# EAGLE design cape (EAGLE 7.2.0)
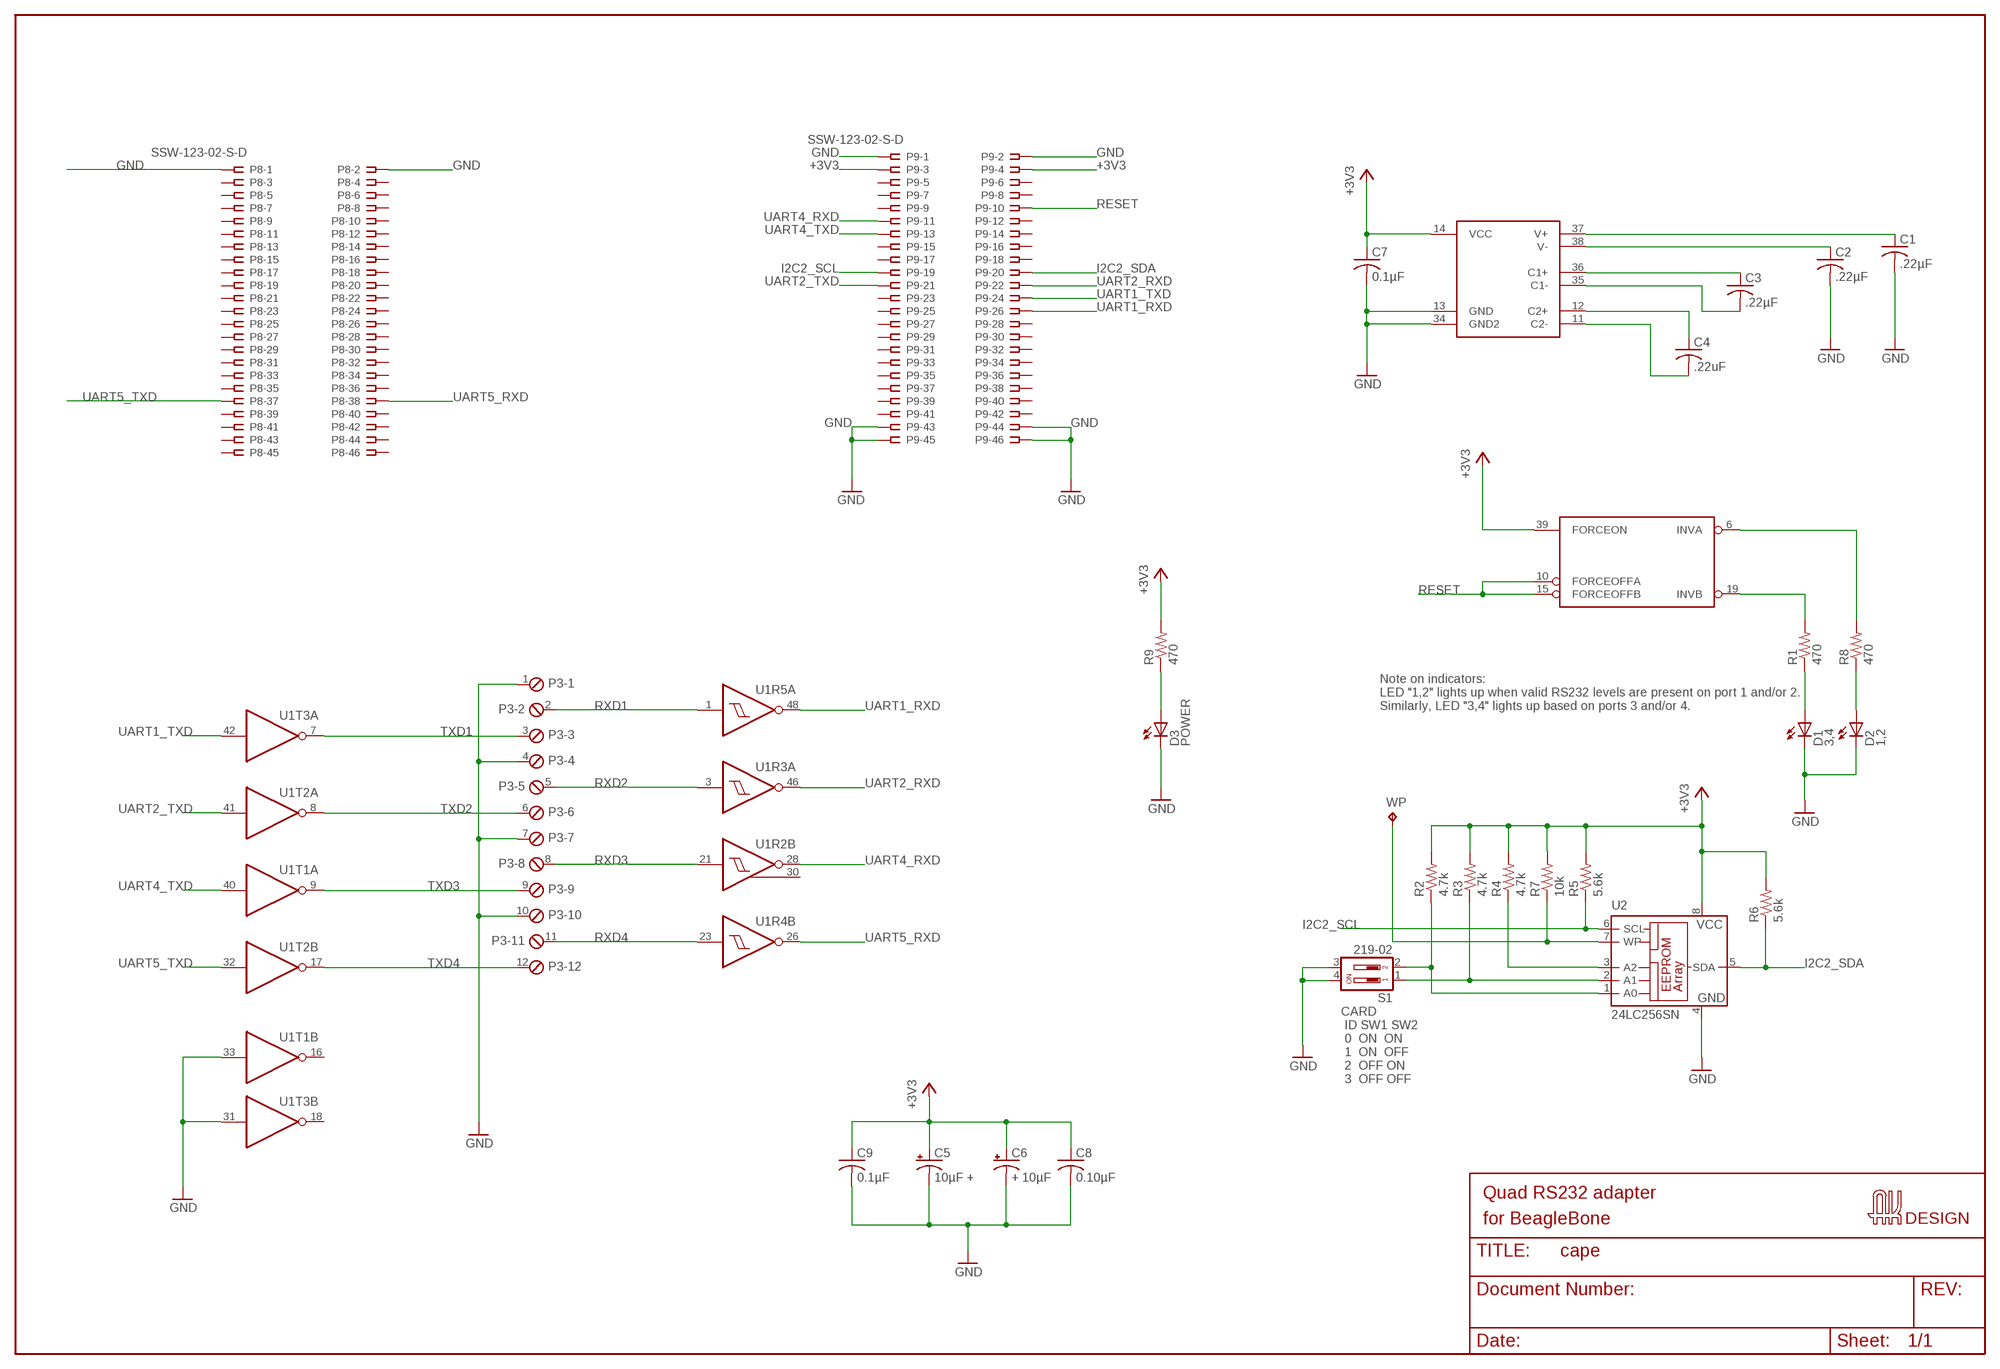
[diagram p0: schematic, sheet 1]

## Parts
C1  .22µF  C-USC0603  [C0603]
C2  .22µF  C-USC0603  [C0603]
C3  .22µF  C-USC0603  [C0603]
C4  .22uF  C-USC0603  [C0603]
C5  10µF +  CPOL-USC1206  [C1206]
C6  + 10µF  CPOL-USC1206  [C1206]
C7  0.1µF  C-USC0603  [C0603]
C8  0.10µF  C-USC0603  [C0603]
C9  0.1µF  C-USC0603  [C0603]
D1  3,4  LEDCHIPLED_0603  [CHIPLED_0603]
D2  1,2  LEDCHIPLED_0603  [CHIPLED_0603]
D3  POWER  LEDCHIPLED_0603  [CHIPLED_0603]
P3  MPT12  [12POL254]
P8  SSW-123-02-S-D  [SSW-123-02-S-D]
P9  SSW-123-02-S-D  [SSW-123-02-S-D]
R1  470  R-US_R0603  [R0603]
R2  4.7k  R-US_R0603  [R0603]
R3  4.7k  R-US_R0603  [R0603]
R4  4.7k  R-US_R0603  [R0603]
R5  5.6k  R-US_R0603  [R0603]
R6  5.6k  R-US_R0603  [R0603]
R7  10k  R-US_R0603  [R0603]
R8  470  R-US_R0603  [R0603]
R9  470  R-US_R0603  [R0603]
S1  219-02  [CTS-219-02]
U1  SN75C23243  SN75C23243SN75C23243DL  [SSOP48DL]
U2  24LC256SN  [SO-08]
U$3  LOGO/PLACE  [LOGO_PLACE]
WP  TPTP15SQ  [TP15SQ]

## Nets
+3V3 [supply]: C5.1(+) C6.1(+) C7.1 C8.1 C9.1 P9.3 P9.4 R2.2 R3.2 R4.2 R5.2 R6.2 R7.2 R9.2 U1.14(POWER:VCC) U1.39(CTRL:FORCEON) U2.8(VCC)
A0: R2.1 S1.2 U2.1(A0)
A1: R3.1 S1.1 U2.2(A1)
A2: R4.1 U2.3(A2)
C1+: C3.1 U1.36(POWER:C1+)
C1-: C3.2 U1.35(POWER:C1-)
C2+: C4.1 U1.12(POWER:C2+)
C2-: C4.2 U1.11(POWER:C2-)
GND [supply]: C1.2 C2.2 C5.2(-) C6.2(-) C7.2 C8.2 C9.2 D1.C D2.C D3.C P3.1 P3.4 P3.7 P3.10 P8.1 P8.2 P9.1 P9.2 P9.43 P9.44 P9.45 P9.46 S1.3 S1.4 U1.13(POWER:GND) U1.31(T3B:I) U1.33(T1B:I) U1.34(POWER:GND2) U2.4(GND)
I2C2_SCL: P9.19 R5.1 U2.6(SCL)
I2C2_SDA: P9.20 R6.1 U2.5(SDA)
INVA: R8.2 U1.6(CTRL:INVA)
INVB: R1.2 U1.19(CTRL:INVB)
LED1_2: D2.A R8.1
LED3_4: D1.A R1.1
N$1: D3.A R9.1
RESET: P9.10 U1.10(CTRL:FORCEOFFA) U1.15(CTRL:FORCEOFFB)
RXD1: P3.2 U1.1(R5A:I)
RXD2: P3.5 U1.3(R3A:I)
RXD3: P3.8 U1.21(R2B:I)
RXD4: P3.11 U1.23(R4B:I)
TXD1: P3.3 U1.7(T3A:O)
TXD2: P3.6 U1.8(T2A:O)
TXD3: P3.9 U1.9(T1A:O)
TXD4: P3.12 U1.17(T2B:O)
UART1_RXD: P9.26 U1.48(R5A:O)
UART1_TXD: P9.24 U1.42(T3A:I)
UART2_RXD: P9.22 U1.46(R3A:O)
UART2_TXD: P9.21 U1.41(T2A:I)
UART4_RXD: P9.11 U1.28(R2B:O)
UART4_TXD: P9.13 U1.40(T1A:I)
UART5_RXD: P8.38 U1.26(R4B:O)
UART5_TXD: P8.37 U1.32(T2B:I)
V+: C1.1 U1.37(POWER:V+)
V-: C2.1 U1.38(POWER:V-)
WP: R7.1 U2.7(WP) WP.TP
Unconnected: P8.3 P8.4 P8.5 P8.6 P8.7 P8.8 P8.9 P8.10 P8.11 P8.12 P8.13 P8.14 P8.15 P8.16 P8.17 P8.18 P8.19 P8.20 P8.21 P8.22 P8.23 P8.24 P8.25 P8.26 P8.27 P8.28 P8.29 P8.30 P8.31 P8.32 P8.33 P8.34 P8.35 P8.36 P8.39 P8.40 P8.41 P8.42 P8.43 P8.44 P8.45 P8.46 P9.5 P9.6 P9.7 P9.8 P9.9 P9.12 P9.14 P9.15 P9.16 P9.17 P9.18 P9.23 P9.25 P9.27 P9.28 P9.29 P9.30 P9.31 P9.32 P9.33 P9.34 P9.35 P9.36 P9.37 P9.38 P9.39 P9.40 P9.41 P9.42 U1.2(R4A:I) U1.4(R2A:I) U1.5(R1A:I) U1.16(T1B:O) U1.18(T3B:O) U1.20(R1B:I) U1.22(R3B:I) U1.24(R5B:I) U1.25(R5B:O) U1.27(R3B:O) U1.29(R1B:O) U1.30(R2B:OINV) U1.43(R2A:OINV) U1.44(R1A:O) U1.45(R2A:O) U1.47(R4A:O)

## Notes on the sheet
- Note on indicators:
  LED "1,2" lights up when valid RS232 levels are present on port 1 and/or 2.
  Similarly, LED "3,4" lights up based on ports 3 and/or 4.
- CARD
   ID SW1 SW2
   0  ON  ON
   1  ON  OFF
   2  OFF ON
   3  OFF OFF
- Quad RS232 adapter
- for BeagleBone

## Library data of the parts
C1-C4 C7-C9 = rcl:C-US: CAPACITOR, American symbol
C5 C6 = resistor:CPOL-US: POLARIZED CAPACITOR, American symbol
D1-D3 = led:LED: LED OSRAM: - CHIPLED LG R971, LG N971, LY N971, LG Q971, LY Q971, LO R971, LY R971 LH N974, LH R974 LS Q976, LO Q976, LY Q976 LO Q996 - Hyper CHIPLED LW Q18S LB Q993, LB Q99A, LB R99A - SideLED LS A670, LO A670, LY A670, LG A670, LP A670 LB A673, LV A673, LT A673, LW A673 LH A674 LY A675 LS A676, LA A676, LO A676, LY A676, LW A676 LS A679, LY A679, LG A679 - Hyper Micro SIDELED® LS Y876, LA Y876, LO Y876, LY Y876 LT Y87S - SmartLED LW L88C, LW L88S LB L89C, LB L89S, LG L890 LS L89K, LO L89K, LY L89K LS L896, LA L896, LO L896, LY L896 - TOPLED LS T670, LO T670, LY T670, LG T670, LP T670 LSG T670, LSP T670, LSY T670, LOP T670, LYG T670 LG T671, LOG T671, LSG T671 LB T673, LV T673, LT T673, LW T673 LH T674 LS T676, LA T676, LO T676, LY T676, LB T676, LH T676, LSB T676, LW T676 LB T67C, LV T67C, LT T67C, LS T67K, LO T67K, LY T67K, LW E67C LS E67B, LA E67B, LO E67B, LY E67B, LB E67C, LV E67C, LT E67C LW T67C LS T679, LY T679, LG T679 LS T770, LO T770, LY T770, LG T770, LP T770 LB T773, LV T773, LT T773, LW T773 LH T774 LS E675, LA E675, LY E675, LS T675 LS T776, LA T776, LO T776, LY T776, LB T776 LHGB T686 LT T68C, LB T68C - Hyper Mini TOPLED® LB M676 - Mini TOPLED Santana® LG M470 LS M47K, LO M47K, LY M47K Source: http://www.osram.convergy.de LUXEON: - LUMILED® LXK2-PW12-R00, LXK2-PW12-S00, LXK2-PW14-U00, LXK2-PW14-V00 LXK2-PM12-R00, LXK2-PM12-S00, LXK2-PM14-U00 LXK2-PE12-Q00, LXK2-PE12-R00, LXK2-PE12-S00, LXK2-PE14-T00, LXK2-PE14-U00 LXK2-PB12-K00, LXK2-PB12-L00, LXK2-PB12-M00, LXK2-PB14-N00, LXK2-PB14-P00, LXK2-PB14-Q00 LXK2-PR12-L00, LXK2-PR12-M00, LXK2-PR14-Q00, LXK2-PR14-R00 LXK2-PD12-Q00, LXK2-PD12-R00, LXK2-PD12-S00 LXK2-PH12-R00, LXK2-PH12-S00 LXK2-PL12-P00, LXK2-PL12-Q00, LXK2-PL12-R00 Source: www.luxeon.com KINGBRIGHT: KA-3528ASYC Source: www.kingbright.com
P3 = con-phoenix-254:MPT12: PHOENIX CONNECTOR
P8 P9 = con-samtec:SSW-123-02-S-D: THROUGH-HOLE .025" SQ POST SOCKET Source: Samtec SSW.pdf; MPN: SSW-123-02-S-D; OC_FARNELL: unknown; OC_NEWARK: 11P9690
R1-R9 = rcl:R-US_: RESISTOR, American symbol
S1 = switch-dil:219-02*: Surface Mount DIP Switch Series 219 SMT CTS Electronic Components Sourc: www.ctscorp.com
U1 = texas:SN75C23243: SN75C23243 dual RS232 port
U2 = microchip:24*: Serial EEPROM I2C
U$3 = akdesign:LOGO
WP = testpad:TP: Test pad

## Net classes
0 default: width 0.254 mm
1 supply: width 0.254 mm

## Board
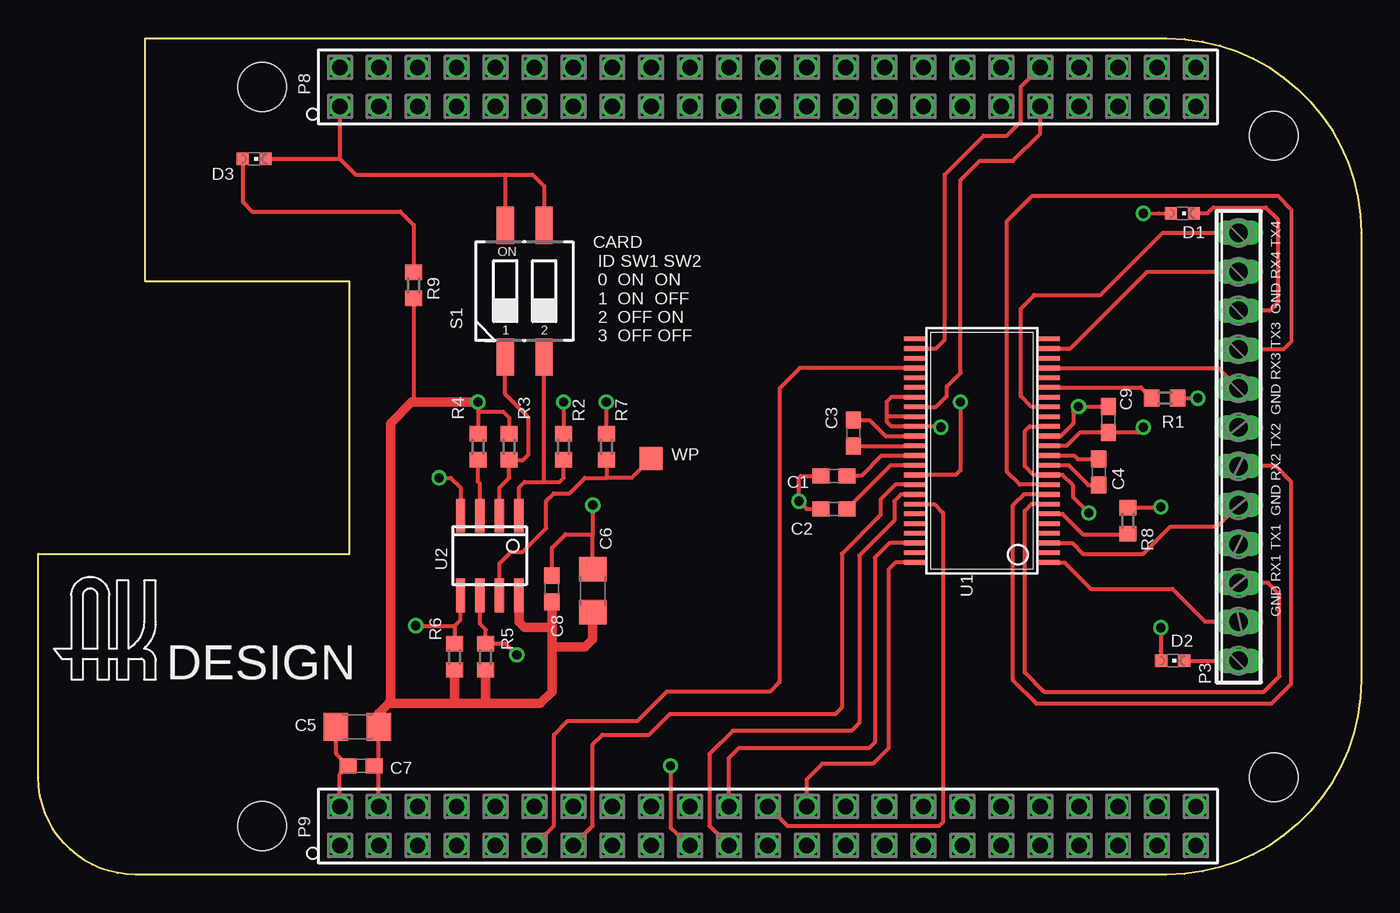
[diagram p1: board, top side]
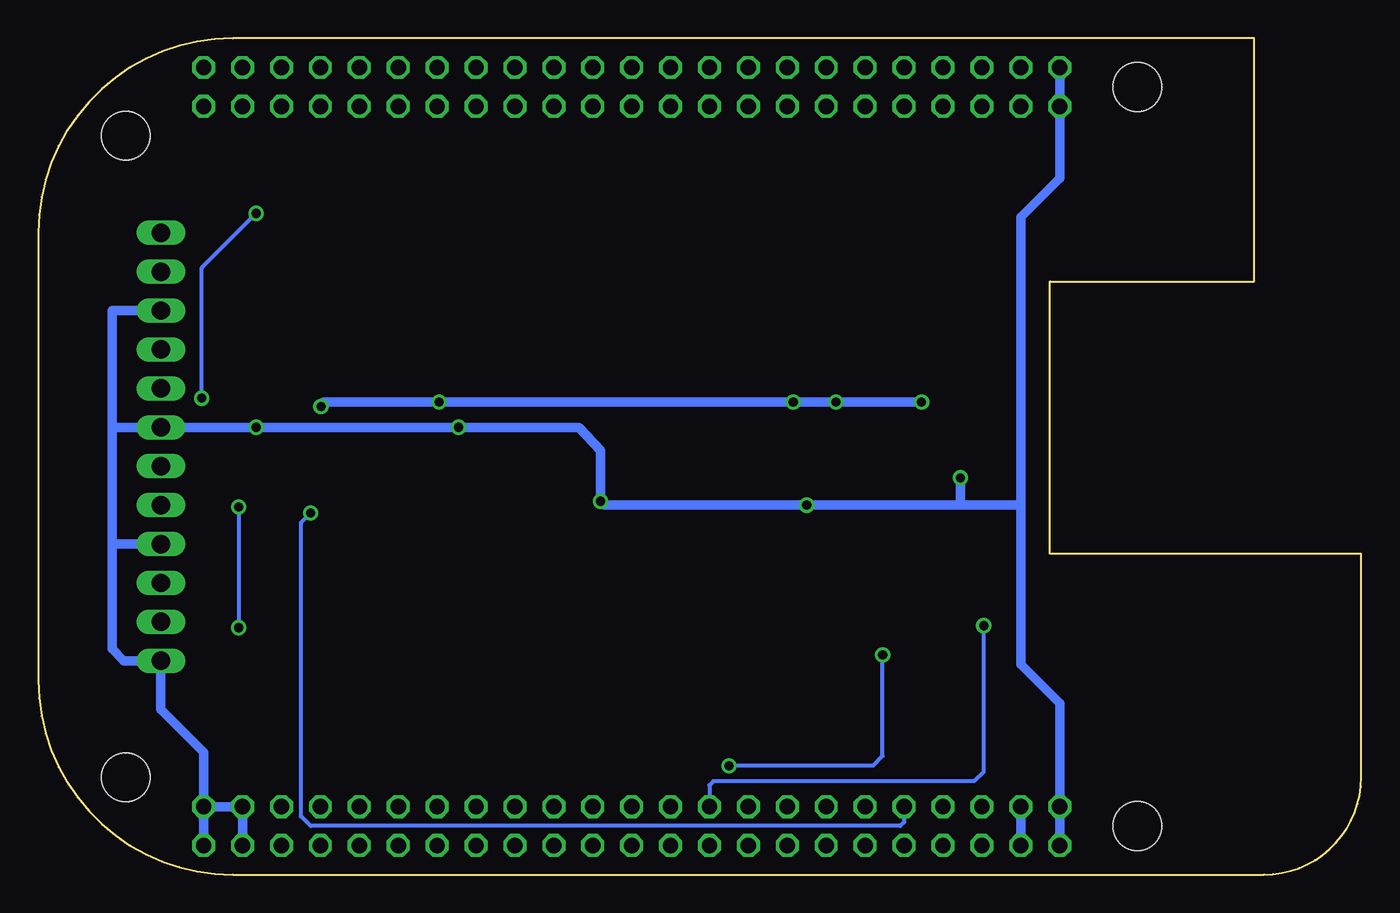
[diagram p2: board, bottom side, seen from below]

Size 86.36 x 54.61 mm. Coordinates in mm from the lower left corner, seen from the top.
Outline: 0,6.35 0,20.95 20.32,20.95 20.32,38.73 6.99,38.73 6.99,54.61 73.66,54.61 arc-90 86.36,41.91 86.36,12.7 arc-90 73.66,0 6.35,0 arc-90 0,6.35
Copper layers (1*16): Top 0.035mm / dielectric 1.5mm / Bottom 0.035mm
Design rules "PCB-POOL Standard via fixed": minimum track width 0.15mm, minimum drill 0.3mm, track to track 0.15mm, track to pad 0.15mm, pad to pad 0.15mm, via to via 0.15mm, smd to smd 0.15mm, copper to edge 0.3mm, drill to drill 0.2mm, minimum pad ring 0.2mm, minimum via ring 0.2mm, stop-mask expansion 0.075mm, vias tented up to drill 0mil, thermal gap 0.2mm
Holes 3.17 mm at 14.61,51.44 80.64,48.26 14.61,3.17 80.64,6.35

### Footprints (pad centres in the part's own frame; a part is rotated, then mirrored left to right if it is on the bottom)
C0603 = smd 1.1 x 1: 1 -0.85,0; 2 0.85,0
C1206 = smd 1.6 x 1.8: 1 -1.4,0; 2 1.4,0
CHIPLED_0603 = smd 0.8 x 0.8: A 0,-0.75; C 0,0.75
12POL254 = drill 1.2 long: 1 -13.97,0; 2 -11.43,0; 3 -8.89,0; 4 -6.35,0; 5 -3.81,0; 6 -1.27,0; 7 1.27,0; 8 3.81,0; 9 6.35,0; 10 8.89,0; 11 11.43,0; 12 13.97,0
SSW-123-02-S-D = drill 1 pad 1.5 octagon: 1 -27.94,-1.27; 2 -27.94,1.27; 3 -25.4,-1.27; 4 -25.4,1.27; 5 -22.86,-1.27; 6 -22.86,1.27; 7 -20.32,-1.27; 8 -20.32,1.27; 9 -17.78,-1.27; 10 -17.78,1.27; 11 -15.24,-1.27; 12 -15.24,1.27; 13 -12.7,-1.27; 14 -12.7,1.27; 15 -10.16,-1.27; 16 -10.16,1.27; 17 -7.62,-1.27; 18 -7.62,1.27; 19 -5.08,-1.27; 20 -5.08,1.27; 21 -2.54,-1.27; 22 -2.54,1.27; 23 0,-1.27; 24 0,1.27; 25 2.54,-1.27; 26 2.54,1.27; 27 5.08,-1.27; 28 5.08,1.27; 29 7.62,-1.27; 30 7.62,1.27; 31 10.16,-1.27; 32 10.16,1.27; 33 12.7,-1.27; 34 12.7,1.27; 35 15.24,-1.27; 36 15.24,1.27; 37 17.78,-1.27; 38 17.78,1.27; 39 20.32,-1.27; 40 20.32,1.27; 41 22.86,-1.27; 42 22.86,1.27; 43 25.4,-1.27; 44 25.4,1.27; 45 27.94,-1.27; 46 27.94,1.27
R0603 = smd 1 x 1.1: 1 -0.85,0; 2 0.85,0
CTS-219-02 = smd 1.13 x 2.44: 1 -1.27,-4.3; 2 1.27,-4.3; 3 1.27,4.3; 4 -1.27,4.3
SSOP48DL = smd 0.305 x 1.397: 1 -7.303,-4.381; 2 -6.668,-4.381; 3 -6.032,-4.381; 4 -5.397,-4.381; 5 -4.763,-4.381; 6 -4.128,-4.381; 7 -3.493,-4.381; 8 -2.857,-4.381; 9 -2.223,-4.381; 10 -1.587,-4.381; 11 -0.953,-4.381; 12 -0.318,-4.381; 13 0.318,-4.381; 14 0.953,-4.381; 15 1.587,-4.381; 16 2.223,-4.381; 17 2.857,-4.381; 18 3.493,-4.381; 19 4.128,-4.381; 20 4.763,-4.381; 21 5.397,-4.381; 22 6.032,-4.381; 23 6.668,-4.381; 24 7.303,-4.381; 25 7.303,4.381; 26 6.668,4.381; 27 6.032,4.381; 28 5.397,4.381; 29 4.763,4.381; 30 4.128,4.381; 31 3.493,4.381; 32 2.857,4.381; 33 2.223,4.381; 34 1.587,4.381; 35 0.953,4.381; 36 0.318,4.381; 37 -0.318,4.381; 38 -0.953,4.381; 39 -1.587,4.381; 40 -2.223,4.381; 41 -2.857,4.381; 42 -3.493,4.381; 43 -4.128,4.381; 44 -4.763,4.381; 45 -5.397,4.381; 46 -6.032,4.381; 47 -6.668,4.381; 48 -7.303,4.381
SO-08 = smd 0.6 x 2.2: 1 -1.905,-2.6; 2 -0.635,-2.6; 3 0.635,-2.6; 4 1.905,-2.6; 5 1.905,2.6; 6 0.635,2.6; 7 -0.635,2.6; 8 -1.905,2.6
TP15SQ = smd 1.5 x 1.5: TP 0,0

### Placement (x,y rotation side)
C1  51.94,26.04 180 top
C2  51.94,23.88 180 top
C3  53.21,28.83 90 top
C4  69.22,26.29 270 top
C5  20.83,9.65 180 top
C6  36.2,18.54 90 top
C7  21.08,7.11 180 top
C8  33.53,18.67 90 top
C9  69.85,29.72 270 top
D1  74.68,43.18 270 top
D2  74.04,13.97 270 top
D3  14.1,46.74 270 top
P3  78.36,27.94 90 top
P8  47.62,51.44 0 top
P9  47.62,3.17 0 top
R1  73.53,31.11 180 top
R2  34.29,27.94 90 top
R3  30.73,27.94 90 top
R4  28.7,27.94 90 top
R5  29.21,14.22 270 top
R6  27.18,14.22 270 top
R7  37.08,27.94 90 top
R8  71.12,23.11 270 top
R9  24.51,38.48 270 top
S1  31.75,38.1 0 top
U1  61.59,27.69 90 top
U2  29.46,20.83 180 top
U$3  1.27,12.57 0 top
WP  40.01,27.18 0 top

### Tracks (layer width: path | path; a pad name or v marks a point on that pad's centre or on a via)
+3V3  (via drill 0.6)
  Top 0.254: P9.4 22.23,6.82 C7.1 22.2,7.38 C5.1 | U1.39 59.88,26.1 60.2,26.42 v60.2,30.86 | U1.14 66.74,28.64 67.56,29.46 67.56,30.23 v67.91,30.57 C9.1 | v34.29,30.86 R2.2 | R3.2 30.73,29.84 30.35,30.23 28.7,30.23 | 28.7,30.23 R4.2 | v28.7,30.86 28.7,30.23 | R7.2 v37.08,30.86 | R9.2 24.51,30.99 24.38,30.86
  Top 0.61: C5.1 22.2,10.52 22.86,11.18 22.99,11.18 | 22.99,11.18 27.18,11.18 | 27.18,11.18 29.21,11.18 | 27.18,11.18 R6.2 | 29.21,11.18 R5.2 | 22.99,11.18 22.99,29.46 24.38,30.86 v28.7,30.86 | C6.1 36.2,15.37 35.69,14.86 33.53,14.86 | C8.1 33.53,16 | 33.53,16 33.53,14.86 | 33.53,14.86 33.53,11.94 32.77,11.18 29.21,11.18 | U2.8 31.37,16.51 31.75,16.13 33.4,16.13 33.53,16
  Bottom 0.61: P9.3 P9.4 | v67.91,30.57 67.74,30.86 v60.2,30.86 v37.08,30.86 v34.29,30.86 v28.7,30.86
A0
  Top 0.254: U2.1 31.37,25.27 31.75,25.65 33.02,25.65 | R2.1 34.29,25.91 34.04,25.65 33.02,25.65 | 33.02,25.65 S1.2
A1
  Top 0.254: U2.2 30.1,25.27 30.73,25.91 R3.1 31.66,27.09 32,27.43 32,29.84 30.48,31.37 S1.1
A2
  Top 0.254: U2.3 28.83,25.53 28.7,25.65 R4.1
C1+
  Top 0.254: U1.36 53.24,28 C3.1
C1-
  Top 0.254: U1.35 55.31,28.64 54.27,29.68 C3.2
C2+
  Top 0.254: C4.1 67.86,27.14 67.63,27.37 U1.12
C2-
  Top 0.254: U1.11 67.25,26.73 68.54,25.44 C4.2
GND  (via drill 0.6)
  Top 0.254: 30.48,45.72 S1.4 | 30.48,45.72 20.7,45.72 19.68,46.74 | P8.1 19.68,46.74 | S1.3 33.02,44.96 32.26,45.72 30.48,45.72 | P9.2 19.68,6.57 C7.2 19.45,7.89 C5.2 | v72.14,29.21 71.79,28.87 C9.2 67.98,28.87 67.12,28 U1.13 | v58.93,29.21 58.74,29.27 U1.34 55.69,29.27 55.37,29.59 55.37,29.97 | C1.2 49.78,26.04 49.66,25.91 v49.66,24.38 50.16,23.88 C2.2 | U2.4 27.56,25.27 26.92,25.91 v26.16,25.91 | C8.2 33.53,21.34 34.42,22.23 36.2,22.23 | C6.2 36.2,22.23 | v36.2,24.13 36.2,22.23 | U1.31 55.69,31.18 55.37,30.86 55.37,29.97 | U1.33 55.44,29.91 55.37,29.97 | D3.C 19.68,46.74 | D2.C P3.1 | D1.C 76.33,43.18 76.71,43.56 80.14,43.56 80.9,42.8 80.9,37.34 80.39,36.83 P3.10
  Bottom 0.406: 49.4,24.13 v49.66,24.38
  Bottom 0.61: P8.2 P8.1 19.68,45.47 22.23,42.93 22.23,24.13 | P9.1 P9.2 19.68,11.18 22.23,13.72 22.23,24.13 | P9.43 P9.44 P9.46 | P9.46 P9.45 | P3.10 81.53,36.83 81.53,29.21 | 81.53,29.21 P3.7 v72.14,29.21 v58.93,29.21 51.05,29.21 49.66,27.69 v49.66,24.38 | 81.53,29.21 81.53,21.59 | 81.53,21.59 P3.4 | 81.53,21.59 81.53,14.73 80.77,13.97 P3.1 78.36,10.79 75.56,8 P9.46 | 26.16,24.13 v36.2,24.13 49.4,24.13 | 22.23,24.13 26.16,24.13 | 26.16,24.13 v26.16,25.91
I2C2_SCL  (via drill 0.6)
  Top 0.254: U2.6 28.83,16.38 29.21,16 R5.1 30.52,15.07 v31.24,14.35 | P9.19 41.27,3.05 v41.27,7.11
  Bottom 0.254: v41.27,7.11 31.88,7.11 31.24,7.75 v31.24,14.35
I2C2_SDA  (via drill 0.6)
  Top 0.254: U2.5 27.56,16.64 27.18,16.26 | 27.18,16.26 R6.1 | v24.64,16.26 27.18,16.26
  Bottom 0.254: P9.20 42.55,5.84 42.29,6.1 25.27,6.1 24.64,6.73 24.64,14.73 24.64,14.86 v24.64,16.26
INVA
  Top 0.254: U1.6 66.86,23.56 68.2,22.23 71.08,22.23 R8.2
INVB
  Top 0.254: U1.19 71.98,31.81 R1.2
LED1_2  (via drill 0.6)
  Top 0.254: R8.1 73.49,23.96 v73.28,24 | v73.28,16.13 73.28,14.62 D2.A
  Bottom 0.254: v73.28,24 v73.28,16.13
LED3_4  (via drill 0.6)
  Top 0.254: R1.1 v75.69,31.11 | v72.14,43.18 73.15,43.17 D1.A
  Bottom 0.254: v75.69,31.11 75.69,39.62 v72.14,43.18
N$1
  Top 0.254: D3.A 13.35,43.93 13.97,43.31 23.62,43.31 24.51,42.42 R9.1
RESET  (via drill 0.6)
  Top 0.254: U1.15 64.71,29.27 64.39,28.96 64.39,26.67 64.96,26.1 U1.10 66.86,26.1 67.56,25.4 67.56,24.64 v68.58,23.62
  Bottom 0.254: v68.58,23.62 69.22,22.99 69.22,3.81 68.58,3.17 30.1,3.17 29.84,3.43 P9.10
RXD1
  Top 0.254: P3.2 76.2,16.51 74.04,18.67 68.71,18.67 66.99,20.38 U1.1
RXD2
  Top 0.254: U1.3 67.5,21.65 68.2,20.95 72.14,20.95 73.91,22.73 76.96,22.73 P3.5
RXD3
  Top 0.254: U1.21 77.03,33.08 P3.8
RXD4
  Top 0.254: U1.23 67.37,34.35 72.39,39.37 P3.11
TXD1
  Top 0.254: P3.3 80.26,19.05 81.03,18.29 81.03,12.95 80.01,11.94 65.66,11.94 64.39,13.21 64.39,23.75 64.83,24.19 U1.7
TXD2
  Top 0.254: P3.6 80.77,26.67 81.79,25.65 81.79,12.45 80.52,11.18 65.15,11.18 63.63,12.7 63.63,24.13 64.33,24.83 U1.8
TXD3
  Top 0.254: U1.9 64.07,25.46 63.25,26.29 63.25,42.67 64.9,44.32 80.9,44.32 81.79,43.43 81.79,34.8 81.28,34.29 P3.9
TXD4
  Top 0.254: U1.17 64.83,30.54 64.14,31.24 64.14,36.96 65.02,37.85 69.34,37.85 73.41,41.91 P3.12
UART1_RXD
  Top 0.254: P9.26 50.16,6.22 51.18,7.24 54.48,7.24 55.5,8.26 55.5,19.94 55.94,20.38 U1.48
UART1_TXD
  Top 0.254: P9.24 48.9,3.17 58.8,3.17 59.05,3.43 59.05,23.62 58.48,24.19 U1.42
UART2_RXD
  Top 0.254: P9.22 45.09,7.62 45.72,8.26 54.23,8.26 54.61,8.64 54.61,20.7 55.56,21.65 U1.46
UART2_TXD
  Top 0.254: P9.21 43.81,3.17 43.81,7.87 45.34,9.4 53.09,9.4 53.59,9.91 53.59,20.83 55.88,23.11 55.88,24.38 56.33,24.83 U1.41
UART4_RXD
  Top 0.254: P9.11 33.66,3.17 33.66,9.14 34.54,10.03 39.12,10.03 41.02,11.94 47.75,11.94 48.39,12.57 48.39,27.3 48.39,27.69 48.39,31.75 49.72,33.08 U1.28
UART4_TXD
  Top 0.254: P9.13 36.2,3.17 36.2,8.51 36.83,9.14 39.88,9.14 41.21,10.48 52.01,10.48 52.45,10.92 52.45,20.95 54.99,23.5 54.99,24.51 55.94,25.46 U1.40
UART5_RXD
  Top 0.254: U1.26 58.61,34.35 59.18,34.92 59.18,45.72 61.72,48.26 63.25,48.26 64.14,49.15 64.14,51.44 P8.38
UART5_TXD
  Top 0.254: P8.37 65.41,48.39 63.63,46.61 61.47,46.61 60.2,45.34 60.2,32.77 59.31,31.88 59.31,31.24 58.61,30.54 U1.32
V+
  Top 0.254: U1.37 55.05,27.37 53.72,26.04 C1.1
V-
  Top 0.254: U1.38 55.65,26.73 C2.1
WP
  Top 0.254: U2.7 30.1,20.32 30.86,21.08 31.62,21.08 33.15,22.61 33.15,24.38 33.66,24.89 34.67,24.89 35.69,25.91 37.08,25.91 | R7.1 37.08,25.91 | WP.TP 38.73,25.91 37.08,25.91

### Text on the board
tNames: GND RX1 TX1 GND RX2 TX2 GND RX3 TX3 GND RX4 TX4 | CARD / ID SW1 SW2 / 0 ON ON / 1 ON OFF / 2 OFF ON / 3 OFF OFF